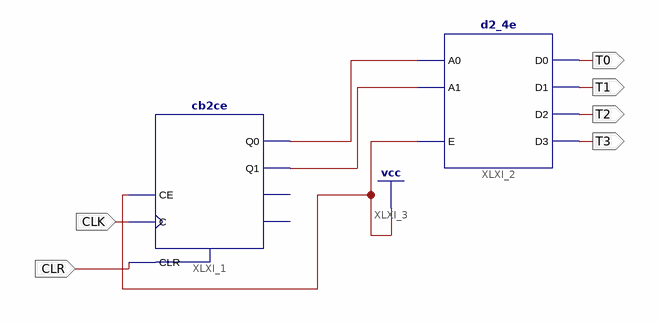
[diagram p0: schematic sheet 1]
// Xilinx ISE schematic sequencer.sch (spartan3e) as structural Verilog: 2 symbols, 6 ports
module sequencer (
  input  CLK,
  input  CLR,
  output T0,
  output T1,
  output T2,
  output T3
);

  wire XLXN_1, XLXN_2;

  cb2ce XLXI_1 (.C(CLK), .CE(1'b1), .CLR(CLR), .Q0(XLXN_1), .Q1(XLXN_2));  // open: CEO, TC
  d2_4e XLXI_2 (.A0(XLXN_1), .A1(XLXN_2), .E(1'b1), .D0(T0), .D1(T1), .D2(T2), .D3(T3));
endmodule
